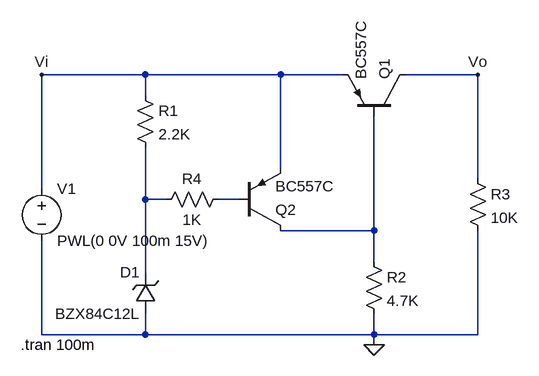
[diagram p0: schematic pnpovervoltage.asc]
pnpovervoltage.asc, the LTspice schematic file:
Version 4
SHEET 1 880 680
WIRE 144 -48 -16 -48
WIRE 352 -48 144 -48
WIRE 448 -48 352 -48
WIRE 656 -48 544 -48
WIRE 144 -16 144 -48
WIRE 352 96 352 -48
WIRE 656 112 656 -48
WIRE -16 128 -16 -48
WIRE 144 144 144 64
WIRE 176 144 144 144
WIRE 288 144 256 144
WIRE 496 192 496 16
WIRE 496 192 352 192
WIRE 496 240 496 192
WIRE 144 256 144 144
WIRE -16 352 -16 208
WIRE 144 352 144 320
WIRE 144 352 -16 352
WIRE 496 352 496 320
WIRE 496 352 144 352
WIRE 656 352 656 192
WIRE 656 352 496 352
WIRE 496 368 496 352
FLAG 496 368 0
FLAG 656 -48 Vo
FLAG -16 -48 Vi
SYMBOL voltage -16 112 R0
WINDOW 123 0 0 Left 0
WINDOW 39 0 0 Left 0
SYMATTR InstName V1
SYMATTR Value PWL(0 0V 100m 15V)
SYMBOL res 128 -32 R0
SYMATTR InstName R1
SYMATTR Value 2.2K
SYMBOL zener 160 320 R180
WINDOW 0 24 64 Left 2
WINDOW 3 24 0 Left 2
SYMATTR InstName D1
SYMATTR Value BZX84C12L
SYMBOL pnp 288 192 M180
SYMATTR InstName Q2
SYMATTR Value BC557C
SYMBOL res 272 128 R90
WINDOW 0 0 56 VBottom 2
WINDOW 3 32 56 VTop 2
SYMATTR InstName R4
SYMATTR Value 1K
SYMBOL pnp 544 16 M270
SYMATTR InstName Q1
SYMATTR Value BC557C
SYMBOL res 480 224 R0
SYMATTR InstName R2
SYMATTR Value 4.7K
SYMBOL res 640 96 R0
SYMATTR InstName R3
SYMATTR Value 10K
TEXT -48 368 Left 2 !.tran 100m

The netlist it stands for:
* pnpovervoltage.asc
V1 Vi 0 PWL(0 0V 100m 15V)
R1 Vi N001 2.2K
D1 0 N001 BZX84C12L
Q2 N003 N002 Vi 0 BC557C
R4 N002 N001 1K
Q1 Vo N003 Vi 0 BC557C
R2 N003 0 4.7K
R3 Vo 0 10K
.model D D
.lib standard.dio
.model NPN NPN
.model PNP PNP
.lib standard.bjt
.tran 100m
.backanno
.end